# Altium schematic sheet Elektriskeem.SchDoc
size A4
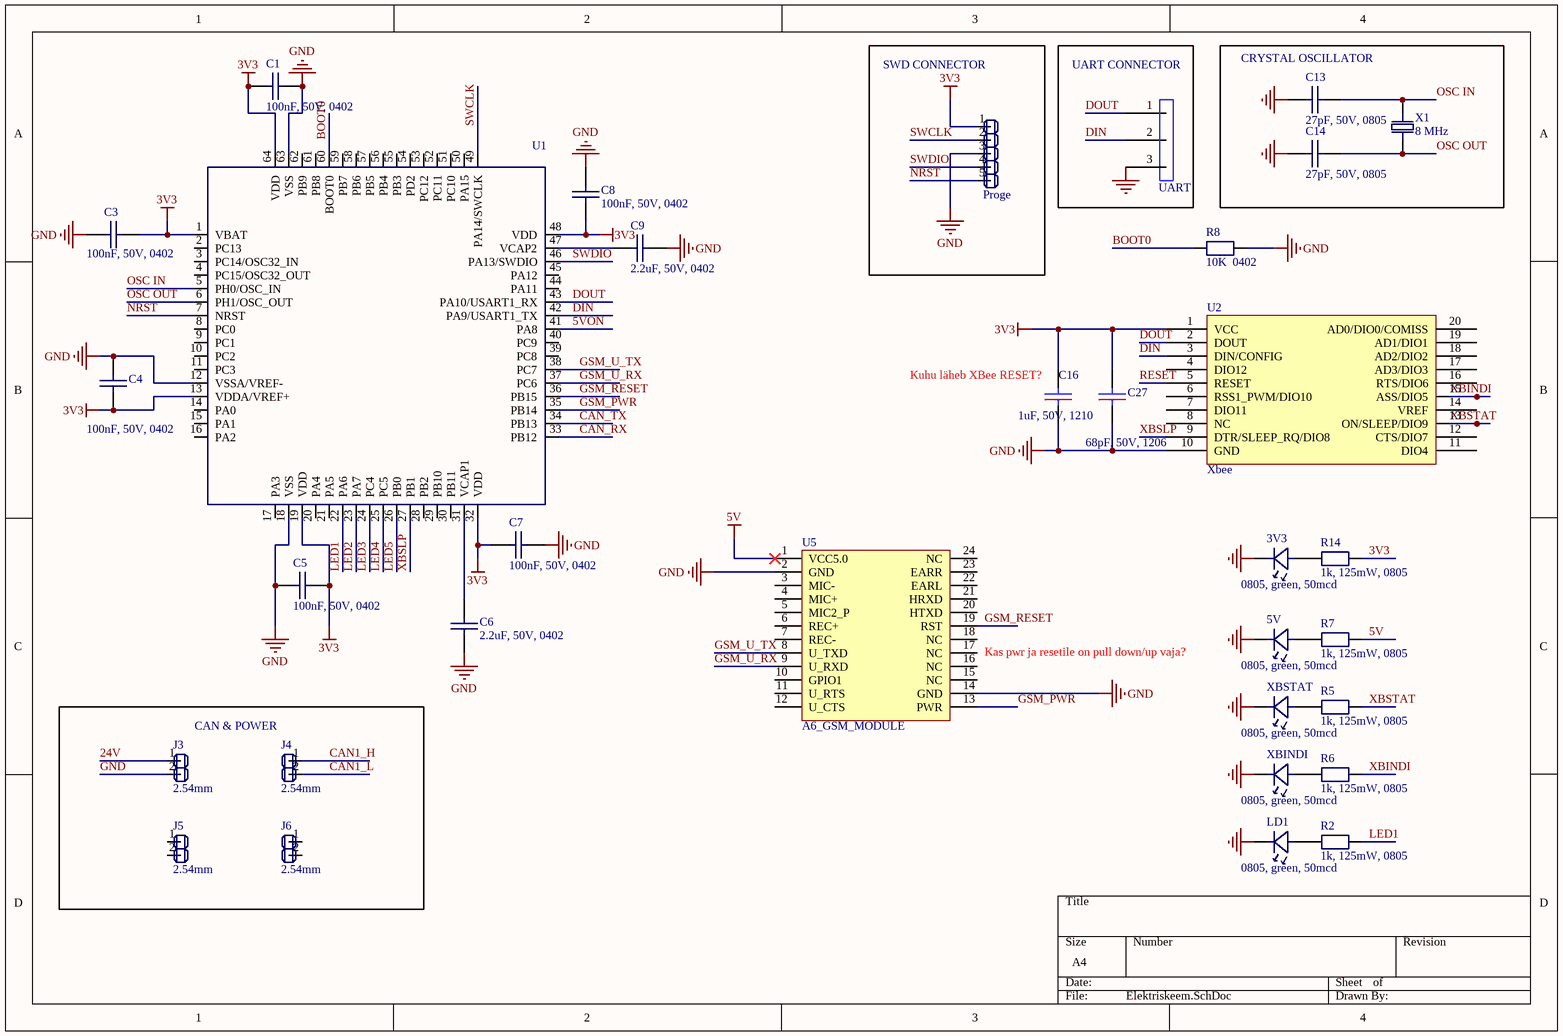
[diagram p0: Elektriskeem.SchDoc]

## Parts
3V3  0805, green, 50mcd  [LED2012X06N]
5V  0805, green, 50mcd  [LED2012X06N]
C1  100nF, 50V, 0402  [1005 [0402] CAP]
C3  100nF, 50V, 0402  [1005 [0402] CAP]
C4  100nF, 50V, 0402  [1005 [0402] CAP]
C5  100nF, 50V, 0402  [1005 [0402] CAP]
C6  2.2uF, 50V, 0402  [1005 [0402] CAP]
C7  100nF, 50V, 0402  [1005 [0402] CAP]
C8  100nF, 50V, 0402  [1005 [0402] CAP]
C9  2.2uF, 50V, 0402  [1005 [0402] CAP]
C13  27pF, 50V, 0805  [2012 [0805] CAP]
C14  27pF, 50V, 0805  [2012 [0805] CAP]
C16  1uF, 50V, 1210  [3225 [1210] CAP]
C27  68pF, 50V, 1206  [3216 [1206] CAP]
J3  2.54mm  [Pin Header 2x1]
J4  2.54mm  [Pin Header 2x1]
J5  2.54mm  [Pin Header 2x1]
J6  2.54mm  [Pin Header 2x1]
LD1  0805, green, 50mcd  [LED2012X06N]
Proge  Pin Header 5x1  [Pin Header 5x1]  (value not drawn)
R2  1k, 125mW, 0805  [2012 [0805] RES]
R5  1k, 125mW, 0805  [2012 [0805] RES]
R6  1k, 125mW, 0805  [2012 [0805] RES]
R7  1k, 125mW, 0805  [2012 [0805] RES]
R8  10K  0402  [1005 [0402] RES]
R14  1k, 125mW, 0805  [2012 [0805] RES]
U1  STM32F4 64-pin  [LQFP64]  (value not drawn)
U2  Xbee  [XBEE - duplicate1]
U5  A6_GSM_MODULE  [A6_gsm_module]
UART  Pin Header 3x1  [Pin Header 3x1]  (value not drawn)
X1  8 MHz  [5.0x3.2 SMD Crystal]
XBINDI  0805, green, 50mcd  [LED2012X06N]
XBSTAT  0805, green, 50mcd  [LED2012X06N]

## Blocks framed on the sheet
SWD CONNECTOR: Proge
UART CONNECTOR: UART
CRYSTAL OSCILLATOR: C13 C14 X1
CAN & POWER: J3-J6

## Nets
3V3: C1.2 C3.1 C4.2 C5.1 C7.2 C8.2 C16.1 C27.1 Proge.1 R14.2 U1.1(VBAT) U1.13(VDDA/VREF+) U1.19(VDD) U1.32(VDD) U1.48(VDD) U1.64(VDD) U2.1(VCC)
5V: R7.2 U5.1(VCC5.0)
GND: 3V3.1 5V.1 C1.1 C3.2 C4.1 C5.2 C6.2 C7.1 C8.1 C9.1 C13.2 C14.1 C16.2 C27.2 J3.2 LD1.1 Proge.3 R8.2 U1.12(VSSA/VREF-) U1.18(VSS) U1.63(VSS) U2.10(GND) U5.2(GND) U5.14(GND) UART.3 XBINDI.1 XBSTAT.1
5VON: U1.41(PA8)
24V: J3.1
BOOT0: R8.1 U1.60(BOOT0)
CAN1_H: J4.1
CAN1_L: J4.2
CAN_RX: U1.33(PB12)
CAN_TX: U1.34(PB13)
DIN: U1.42(PA9/USART1_TX) U2.3(DIN/CONFIG) UART.2
DOUT: U1.43(PA10/USART1_RX) U2.2(DOUT) UART.1
GSM_PWR: U1.35(PB14) U5.13(PWR)
GSM_RESET: U1.36(PB15) U5.19(RST)
GSM_U_RX: U1.37(PC6) U5.9(U_RXD)
GSM_U_TX: U1.38(PC7) U5.8(U_TXD)
LED1: R2.2 U1.22(PA6)
LED2: U1.23(PA7)
LED3: U1.24(PC4)
LED4: U1.25(PC5)
LED5: U1.26(PB0)
NRST: Proge.5 U1.7(NRST)
OSC IN: C13.1 U1.5(PH0/OSC_IN) X1.1
OSC OUT: C14.2 U1.6(PH1/OSC_OUT) X1.2
RESET: U2.5(RESET)
SWCLK: Proge.2 U1.49(PA14/SWCLK)
SWDIO: Proge.4 U1.46(PA13/SWDIO)
XBINDI: R6.2 U2.15(ASS/DIO5)
XBSLP: U1.27(PB1) U2.9(DTR/SLEEP_RQ/DIO8)
XBSTAT: R5.2 U2.13(ON/SLEEP/DIO9)
Net3V3_2: 3V3.2 R14.1
Net5V_2: 5V.2 R7.1
NetC6_1: C6.1 U1.31(VCAP1)
NetC9_2: C9.2 U1.47(VCAP2)
NetLD1_2: LD1.2 R2.1
NetR5_1: R5.1 XBSTAT.2
NetR6_1: R6.1 XBINDI.2

Not connected (* = marked no-connect by the designer): J5 1 2; J6 1 2; U1 2(PC13) 3(PC14/OSC32_IN) 4(PC15/OSC32_OUT) 8(PC0) 9(PC1) 10(PC2) 11(PC3) 14(PA0) 15(PA1) 16(PA2) 17(PA3) 20(PA4) 21(PA5) 28(PB2) 29(PB10) 30(PB11) 39(PC8) 40(PC9) 44(PA11) 45(PA12) 50(PA15) 51(PC10) 52(PC11) 53(PC12) 54(PD2) 55(PB3) 56(PB4) 57(PB5) 58(PB6) 59(PB7) 61(PB8) 62(PB9); U2 4(DIO12) 6(RSS1_PWM/DIO10) 7(DIO11) 8(NC) 11(DIO4) 12(CTS/DIO7) 14(VREF) 16(RTS/DIO6) 17(AD3/DIO3) 18(AD2/DIO2) 19(AD1/DIO1) 20(AD0/DIO0/COMISS); U5 3(MIC-) 4(MIC+) 5(MIC2_P) 6(REC+) 7(REC-) 10(GPIO1) 11(U_RTS) 12(U_CTS) 15(NC) 16(NC) 17(NC) 18(NC) 20(HTXD) 21(HRXD) 22(EARL) 23(EARR) 24(NC)

## Notes on the sheet
- (near C16) Kuhu läheb XBee RESET?
- Kas pwr ja resetile on pull down/up vaja?

## Library data of the parts
3V3 5V LD1 XBINDI XBSTAT = LED: Cathode (-) marked by silkscreen line; Manufacturer: KINGBRIGHT; Product Name: KP-2012CGCK; Product Number: Farnell 2290331
C1 C3-C9 = Capacitor: Manufacturer: *; Product Name: *; Supplier Number: *; Supplier: Farnell; Notes: *
C13 C14 = Capacitor: Manufacturer: KEMET; Product Name: C0805C270J5GACTU; Product Number: Farnell 1414683
C16 = Capacitor: Product Number: GRM32ER71H105KA01L; Manufacturer: *; Product Name: *
C27 = Capacitor: Product Number: 12065A680JAT2A; Manufacturer: *; Product Name: *
J3-J6 = Pin Header 2x1: Manufacturer: *; Product Name: *; Supplier Number: *; Supplier: *; Notes: *
Proge = Pin Header 5x1: Manufacturer: TE CONNECTIVITY; Product Name: 640456-5; Product Number: Farnell 588600
R2 R5-R7 R14 = Resistor: Manufacturer: VISHAY DRALORIC; Product Name: CRCW08051K00FKTA; Product Number: Farnell 1652936
R8 = Resistor: Manufacturer: *; Product Name: *; Supplier Number: *; Supplier: Farnell; Notes: *
U1 = STM32F4 64-pin: Manufacturer: STMICROELECTRONICS; Product Name: STM32F405RGT6W; Product Number: Farnell 2333283
X1 = Crystal: Manufacturer: ABRACON; Product Name: ABM3-8.000MHZ-D2Y-T; Product Number: Farnell 2101329
UART = Pin Header 3x1: Manufacturer: *; Product Name: *; Product Number: *